# Altium schematic sheet Sheet1.SchDoc
size A4; SheetNumber: 1; SheetTotal: 2
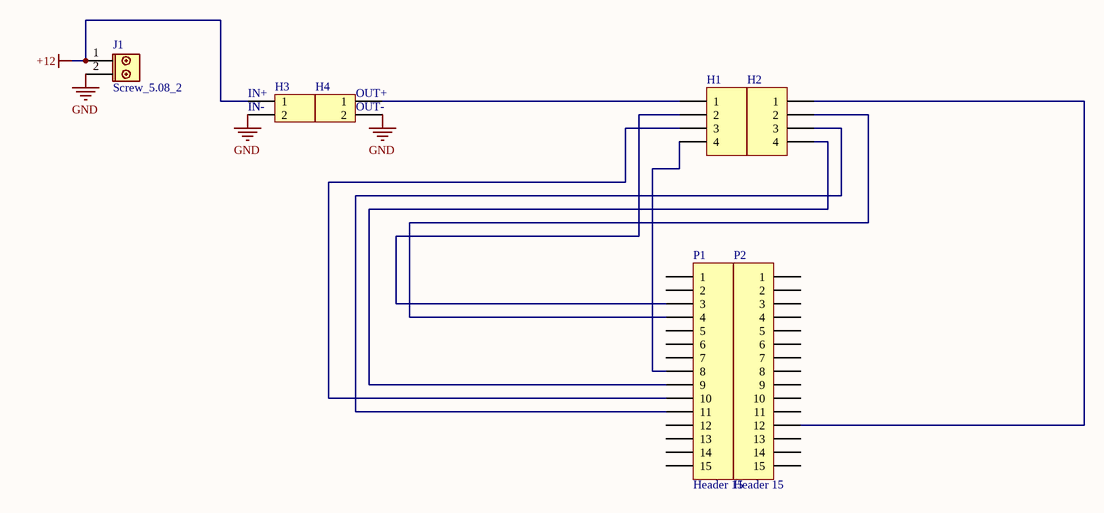
[diagram p0: Sheet1.SchDoc]

## Parts
H1  Header 4  [HDR1X4]  (value not drawn)
H2  Header 4  [HDR1X4]  (value not drawn)
H3  Header 2  [HDR1X2]  (value not drawn)
H4  Header 2  [HDR1X2]  (value not drawn)
J1  Screw_5.08_2  [ScrewTerm_2.54_2]
P1  Header 15  [HDR1X15]
P2  Header 15  [HDR1X15]

## Nets
+12: H3.1 J1.1
GND: H3.2 H4.2 J1.2
NetH1_1: H1.1 H4.1
NetH1_2: H1.2 P1.3
NetH1_3: H1.3 P1.10
NetH1_4: H1.4 P1.8
NetH2_1: H2.1 P2.12
NetH2_2: H2.2 P1.4
NetH2_3: H2.3 P1.11
NetH2_4: H2.4 P1.9

Not connected (* = marked no-connect by the designer): P1 1 2 5 6 7 12 13 14 15; P2 1 2 3 4 5 6 7 8 9 10 11 13 14 15

## Notes on the sheet
- (near H3) IN+
- (near H3) IN-
- (near H4) OUT-
- (near H4) OUT+

## Library data of the parts
H1 H2 = Header 4: Header, 4-Pin; Manufacturer: Generic Components; Class: Connector
H3 H4 = Header 2: Header, 2-Pin; Manufacturer: Generic Components; Class: Connector
J1 = Screw_5.08_2: 2 way screw terminal connector
P1 P2 = Header 15: Header, 15-Pin; LatestRevisionDate: 17-Jul-2002; LatestRevisionNote: Re-released for DXP Platform.; Publisher: Altium Limited